# Altium schematic sheet 2024 LV BMS.SchDoc
size A
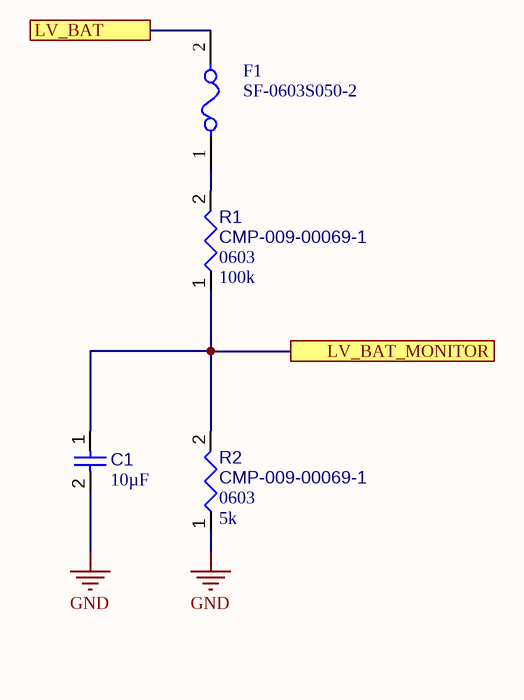
[diagram p0: 2024 LV BMS.SchDoc]

## Parts
C1  value 10µF  [CAPC0603(1608)100_L]  (hidden comment: CMP-001-00016-4)
F1  SF-0603S050-2  [FP-SF-0603S-MFG]
R1  CMP-009-00069-1  value 100k  Case/Package: 0603  [RESC0603(1608)_L]
R2  CMP-009-00069-1  value 5k  Case/Package: 0603  [RESC0603(1608)_L]

## Ports
LV_BAT, LV_BAT_MONITOR

## Nets
GND: C1.2 R2.1
LV_BAT: F1.2 ; port LV_BAT
LV_BAT_MONITOR: C1.1 R1.1 R2.2 ; port LV_BAT_MONITOR
NetF1_1: F1.1 R1.2

## Library data of the parts
C1 = CMP-005-000576-1: Chip Capacitor, 10 uF, +/- 10%, 16 V, 1206 (3216 Metric); Voltage Rating: 16V; Capacitor Type: Ceramic; Available Preview Images: 2D; Pins: 2; Tolerance: 10%; Mounting Technology: SM; RoHS Compliant: True; Case/Package: 1206; Max Operating Temperature: 125°C; Min Operating Temperature: -55°C; Design Item ID: CMP-001-00016-4; Source: Integrated_Library - 12.03.21 - 15.39.SchLib
F1 = CMP-07399-000004-1: FUSE BOARD MNT 500MA 50VDC 0603; Manufacturer: Bourns Inc.; Fuse I2T: 0.009A2Sec; Description: 500mA AC 50V DC Fuse Board Mount (Cartridge Style Excluded) Surface Mount 0603 (1608 Metric); Fuse Current: 0.5A; Fuse Interrupt Ac Current: 50A; Max Fuse Ac Voltage: 35V; Resistance: 232mΩ; Fuse Blow Speed: Slow; Value: 232mΩ; Max Fuse Dc Voltage: 50V; Automotive: No; Category: Fuse; Temperature Range High: +105°C; Device Class L1: Circuit Protection; Height: 0.55mm; RoHS: TRUE; ComponentLink2URL: https://www.bourns.com/docs/product-datasheets/sf0603s.pdf; Ipc Land Pattern Name: CAPC16080X45; Temperature Range Low: -20°C; Mouser Description: Surface Mount Fuses 0.50A Slow Blow SinglFuse; Manufacturer Part Number: SF-0603S050-2; Package: SF-0603S; Device Class L3: unset; Digikey Description: FUSE BOARD MNT 500MA 50VDC 0603; Device Class L2: Fuses; Lead Free: Yes; Temperature: -20°C to +105°C; ComponentLink2Description: Datasheet; Octopart: https://octopart.com/sf-0603s050-2-bourns-10486821; Fuse Interrupt Dc Current: 50A
R1 R2 = CMP-009-000068-1: 120R 0.1W 5% 0603 (1608 Metric)  SMD; Case-Metric: 1608; Available Preview Images: 2D; Case-EIA: 0603; Technology: SMT; Design Item ID: CMP-009-00069-1; Source: Integrated_Library - 12.03.21 - 15.39.SchLib